# Altium schematic sheet Power.SchDoc
size A3
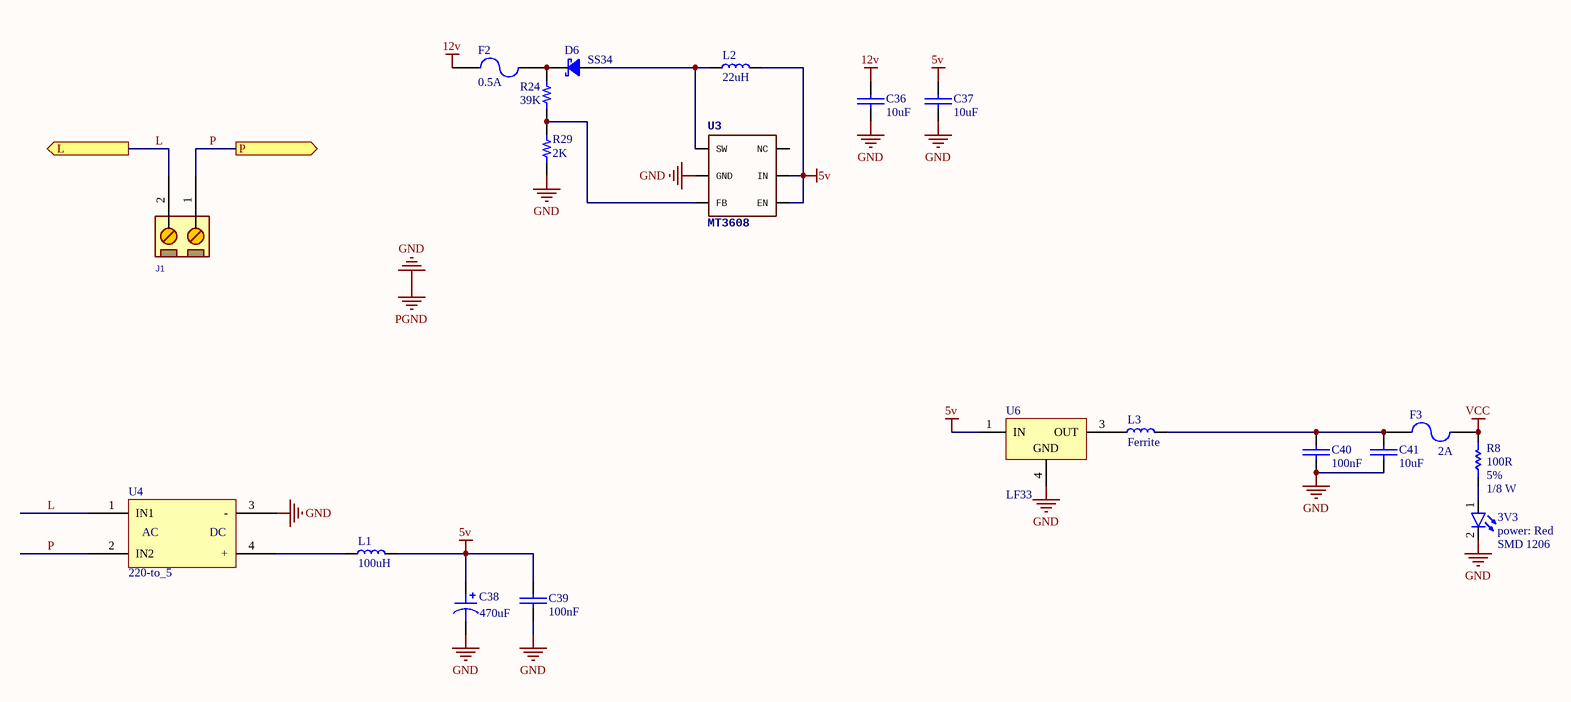
[diagram p0: Power.SchDoc]

## Parts
3V3  power: Red  Size: SMD 1206  [LED_1206_RED]
C36  10uF  [CAP 0603_1608]
C37  10uF  [CAP 0603_1608]
C38  470uF  [CAP TAN SMD 7343]
C39  100nF  [CAP 0603_1608]
C40  100nF  [CAP 0805_2012]
C41  10uF  [CAP 0805_2012]
D6  SS34  [DO-214AC SMA]
F2  value 0.5A  [FUSE_1206]  (hidden comment: Fuse 0805)
F3  value 2A  [FUSE_1206]  (hidden comment: Fuse 1206)
J1  CONN_TB2  [P_TBB_2]  (value not drawn)
L1  value 100uH  [IND 10X11MM]  (hidden comment: Inductor SMD POWER 10X11mm)
L2  value 22uH  [IND 5X5MM]  (hidden comment: Inductor SMD POWER 10X11mm)
L3  Ferrite  [IND 1206_3216]
R8  Tolerance: 5%  Power: 1/8 W  [RES 0805_2012]  (hidden comment: 100R)
R24  39K  [RES 0805_2012]
R29  2K  [RES 0805_2012]
U3  MT3608  [SOT-23-6 2.9X2.8MM P0.95MM]
U4  220-to_5  [HLK_5W]
U6  LF33  [TO252]

## Ports
L (out), P (out)

## Nets
5v: C37.2(-) C38.1 C39.2(-) L1.2 L2.2 U3.4(EN) U3.5(IN) U6.1(IN)
12v: C36.2(-) F2.1
GND: 3V3.2(K) C36.1(+) C37.1(+) C38.2 C39.1(+) C40.2(-) C41.2(-) R29.1 U3.2(GND) U4.3(-) U6.4(GND)  [also labelled PGND]
VCC: F3.2 R8.2
L: J1.2 U4.1(IN1) ; port L
P: J1.1 U4.2(IN2) ; port P
Net3V3_1: 3V3.1(A) R8.1
NetC40_1: C40.1(+) C41.1(+) F3.1 L3.2
NetD6_1: D6.1 L2.1 U3.1(SW)
NetD6_2: D6.2 F2.2 R24.2
NetL1_1: L1.1 U4.4(+)
NetL3_1: L3.1 U6.3(OUT)
NetR24_1: R24.1 R29.2 U3.3(FB)

Not connected (* = marked no-connect by the designer): U3 6(NC)

## Notes on the sheet
- (in symbol H-Link) AC; DC

## Library data of the parts
3V3 = LED: Designer: Saeid Jorablo; Organazation: ControTec; Adding Date: 1387/12/22
C36 C37 C39-C41 = Cap-Bipolar: Bipolar Capacitor; Voltage: 100V; Designer: Saeid Jorablo; Organazation: ControTec; Adding Date: 1387/12/20
  C36 C37 C41: Value: 10uF
  C39 C40: Value: 100nF
C38 = Pol Cap SMD TAN 7343 SIZE D: SMT TAN Polarised Capacitor; Value: 470uF
D6 = 1N5822 (THD): Diode Schottky 40V 3A Through Hole DO-201AD; PartNumber: 1N5822-E3/54
J1 = TB2 BLUE: CONN, TERMINAL BLOCK, 5.08mm pitch; VALUE: CONN_TB2
L1 L2 = Inductor SMD POWER 10X11mm: SMT Inductor
L3 = Ind 1206: SMT Inductor; Value: Ferrite
R8 = Resistor: Value: 100R
R24 R29 = Res 0805: SMT Resistor
  R24: VALUE: 39K
  R29: VALUE: 2K
U3 = MT3608 (SMD): Boost chip; PartNumber: MT3608
U4 = H-Link: Isolated 3W Power Module
U6 = LF33 (SMD): 500mA, Very Low Drop (0.45V) Voltage Regulator, 3.3V, 3-Pin DPAK, Tape and Reel; PartNumber: LF33CDT-TR; DatasheetVersion: Nov-2010; PackageVersion: 2011; PackageReference: TO-252; PackageDescription: 3-Pin Transistor Outline Package 2.28 mm Pitch, 9.7 mm Lead Span (DPAK); ComponentLink1Description: Manufacturer URL; ComponentLink1URL: http://www.st.com; ComponentLink2Description: Datasheet; ComponentLink2URL: http://www.st.com/internet/com/TECHNICAL_RESOURCES/TECHNICAL_LITERATURE/DATASHEET/CD00000546.pdf